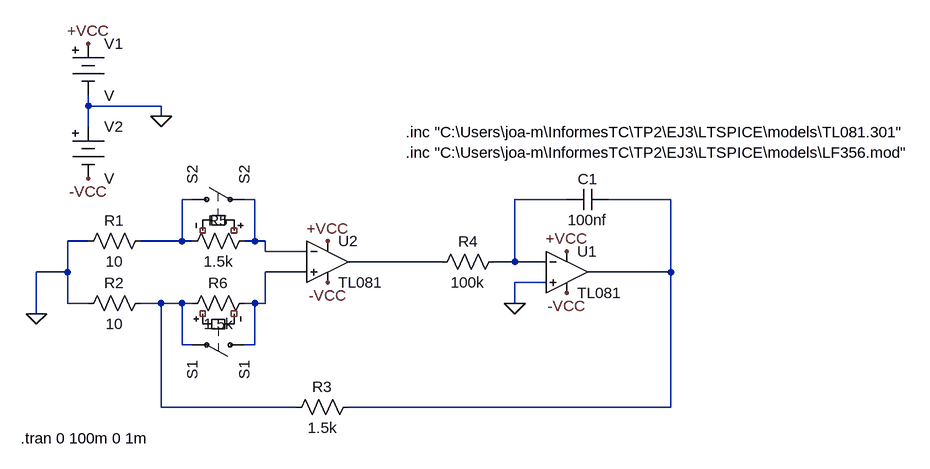
[diagram p0: schematic EJ4.asc]
EJ4.asc, the LTspice schematic file:
Version 4
SHEET 1 1348 680
WIRE 32 -80 32 -96
WIRE 144 -80 32 -80
WIRE 144 -64 144 -80
WIRE 32 -48 32 -80
WIRE 192 64 176 64
WIRE 288 64 272 64
WIRE 768 64 688 64
WIRE 928 64 832 64
WIRE 32 128 0 128
WIRE 176 128 176 64
WIRE 176 128 112 128
WIRE 192 128 176 128
WIRE 288 128 288 64
WIRE 288 128 272 128
WIRE 304 128 288 128
WIRE 304 144 304 128
WIRE 368 144 304 144
WIRE 576 160 432 160
WIRE 688 160 688 64
WIRE 688 160 656 160
WIRE 736 160 688 160
WIRE 0 176 0 128
WIRE 0 176 -48 176
WIRE 368 176 304 176
WIRE 928 176 928 64
WIRE 928 176 800 176
WIRE 736 192 688 192
WIRE 0 224 0 176
WIRE 32 224 0 224
WIRE 144 224 112 224
WIRE 176 224 144 224
WIRE 192 224 176 224
WIRE 288 224 272 224
WIRE 304 224 304 176
WIRE 304 224 288 224
WIRE 688 224 688 192
WIRE -48 240 -48 176
WIRE 176 288 176 224
WIRE 192 288 176 288
WIRE 288 288 288 224
WIRE 288 288 272 288
WIRE 144 384 144 224
WIRE 352 384 144 384
WIRE 928 384 928 176
WIRE 928 384 432 384
FLAG 688 224 0
FLAG -48 240 0
FLAG 32 -176 +VCC
FLAG 32 32 -VCC
FLAG 144 -64 0
FLAG 400 128 +VCC
FLAG 768 144 +VCC
FLAG 400 192 -VCC
FLAG 768 208 -VCC
SYMBOL res 128 112 R90
WINDOW 0 0 56 VBottom 2
WINDOW 3 32 56 VTop 2
SYMATTR InstName R1
SYMATTR Value 10
SYMBOL res 128 208 R90
WINDOW 0 0 56 VBottom 2
WINDOW 3 32 56 VTop 2
SYMATTR InstName R2
SYMATTR Value 10
SYMBOL res 448 368 R90
WINDOW 0 0 56 VBottom 2
WINDOW 3 32 56 VTop 2
SYMATTR InstName R3
SYMATTR Value 1.5k
SYMBOL res 672 144 R90
WINDOW 0 0 56 VBottom 2
WINDOW 3 32 56 VTop 2
SYMATTR InstName R4
SYMATTR Value 100k
SYMBOL res 288 112 R90
WINDOW 0 0 56 VBottom 2
WINDOW 3 32 56 VTop 2
SYMATTR InstName R5
SYMATTR Value 1.5k
SYMBOL res 288 208 R90
WINDOW 0 0 56 VBottom 2
WINDOW 3 32 56 VTop 2
SYMATTR InstName R6
SYMATTR Value 1.5k
SYMBOL cap 832 48 R90
WINDOW 0 0 32 VBottom 2
WINDOW 3 32 32 VTop 2
SYMATTR InstName C1
SYMATTR Value 100nf
SYMBOL Opamps\\opamp2 768 112 R0
SYMATTR InstName U1
SYMATTR Value TL081
SYMATTR SpiceModel TL081
SYMBOL Opamps\\opamp2 400 96 R0
SYMATTR InstName U2
SYMATTR Value TL081
SYMATTR SpiceModel TL081
SYMBOL sw 288 288 R90
SYMATTR InstName S1
SYMATTR SpiceModel 1P3T
SYMATTR Value S1
SYMBOL sw 176 64 R270
SYMATTR InstName S2
SYMATTR SpiceModel 1P3T
SYMATTR Value S2
SYMBOL Misc\\battery 32 -192 R0
SYMATTR InstName V1
SYMBOL Misc\\battery 32 -64 R0
SYMATTR InstName V2
TEXT 520 -40 Left 2 !.inc "C:\\Users\\joa-m\\InformesTC\\TP2\\EJ3\\LTSPICE\\models\\TL081.301"
TEXT 520 -8 Left 2 !.inc "C:\\Users\\joa-m\\InformesTC\\TP2\\EJ3\\LTSPICE\\models\\LF356.mod"
TEXT -72 432 Left 2 !.tran 0 100m 0 1m

The netlist it stands for:
* EJ4.asc
R1 N001 0 10
R2 N007 0 10
R3 N004 N007 1.5k
R4 N003 N005 100k
R5 N002 N001 1.5k
R6 N006 N007 1.5k
C1 N004 N003 100nf
XU1 0 N003 +VCC -VCC N004 TL081 TL081  ; pins In+ In- V+ V- OUT
XU2 N006 N002 +VCC -VCC N005 TL081 TL081  ; pins In+ In- V+ V- OUT
S1 N006 N007 NC_01 NC_02 1P3T S1
S2 N001 N002 NC_03 NC_04 1P3T S2
V1 +VCC 0 V
V2 0 -VCC V
.inc "C:\Users\joa-m\InformesTC\TP2\EJ3\LTSPICE\models\TL081.301"
.inc "C:\Users\joa-m\InformesTC\TP2\EJ3\LTSPICE\models\LF356.mod"
.tran 0 100m 0 1m
.backanno
.end